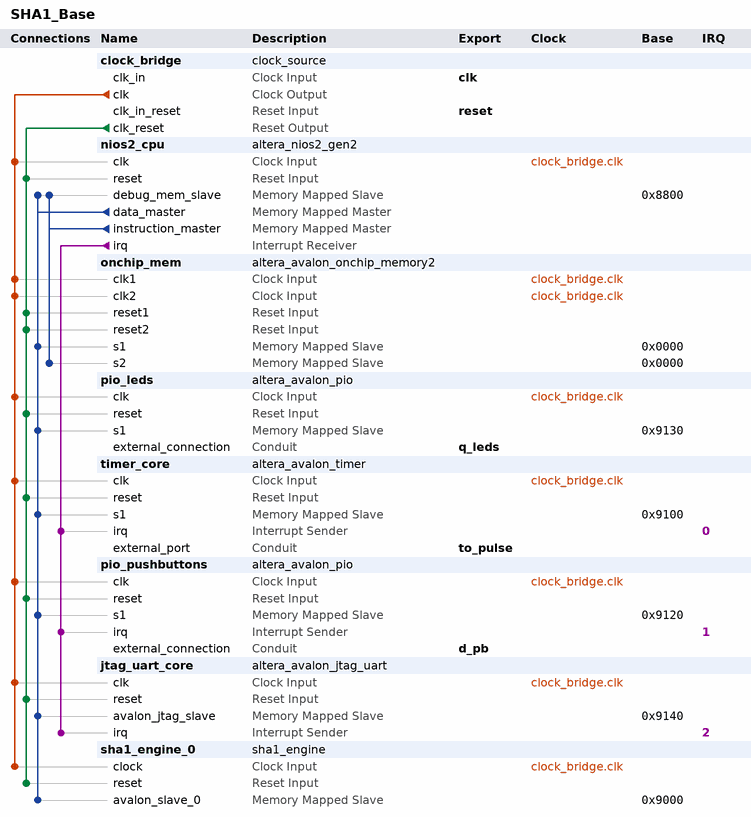
[diagram p0: system contents]
# Platform Designer (Qsys) system SHA1_Base, MAX 10 10M50DAF484C6GES
# Parameters at their usual value, and those the tool derives, are not listed.
package require -exact qsys 18.1
create_system SHA1_Base
set_project_property DEVICE_FAMILY {MAX 10}
set_project_property DEVICE 10M50DAF484C6GES

add_instance clock_bridge clock_source 18.1
set_instance_parameter_value clock_bridge clockFrequency 50000000

add_instance nios2_cpu altera_nios2_gen2 18.1
set_instance_parameter_value nios2_cpu dcache_size 2048
set_instance_parameter_value nios2_cpu exceptionSlave onchip_mem.s2
set_instance_parameter_value nios2_cpu icache_size 4096
set_instance_parameter_value nios2_cpu impl Fast
set_instance_parameter_value nios2_cpu resetSlave onchip_mem.s2

add_instance onchip_mem altera_avalon_onchip_memory2 18.1
set_instance_parameter_value onchip_mem dataWidth 32
set_instance_parameter_value onchip_mem dualPort true
set_instance_parameter_value onchip_mem initMemContent false
set_instance_parameter_value onchip_mem initializationFileName onchip_mem.hex
set_instance_parameter_value onchip_mem memorySize 30000

add_instance pio_leds altera_avalon_pio 18.1
set_instance_parameter_value pio_leds direction Output
set_instance_parameter_value pio_leds width 8

add_instance timer_core altera_avalon_timer 18.1
set_instance_parameter_value timer_core period 1
set_instance_parameter_value timer_core periodUnits MSEC
set_instance_parameter_value timer_core timeoutPulseOutput true

add_instance pio_pushbuttons altera_avalon_pio 18.1
set_instance_parameter_value pio_pushbuttons bitClearingEdgeCapReg true
set_instance_parameter_value pio_pushbuttons captureEdge true
set_instance_parameter_value pio_pushbuttons direction Input
set_instance_parameter_value pio_pushbuttons edgeType FALLING
set_instance_parameter_value pio_pushbuttons generateIRQ true
set_instance_parameter_value pio_pushbuttons irqType EDGE
set_instance_parameter_value pio_pushbuttons width 2

add_instance jtag_uart_core altera_avalon_jtag_uart 18.1
set_instance_parameter_value jtag_uart_core simInteractiveOptions NO_INTERACTIVE_WINDOWS

add_instance sha1_engine_0 sha1_engine 1.0

# connections
add_connection clock_bridge.clk jtag_uart_core.clk clock
add_connection clock_bridge.clk nios2_cpu.clk clock
add_connection clock_bridge.clk onchip_mem.clk1 clock
add_connection clock_bridge.clk onchip_mem.clk2 clock
add_connection clock_bridge.clk pio_leds.clk clock
add_connection clock_bridge.clk pio_pushbuttons.clk clock
add_connection clock_bridge.clk sha1_engine_0.clock clock
add_connection clock_bridge.clk timer_core.clk clock
add_connection clock_bridge.clk_reset jtag_uart_core.reset reset
add_connection clock_bridge.clk_reset nios2_cpu.reset reset
add_connection clock_bridge.clk_reset onchip_mem.reset1 reset
add_connection clock_bridge.clk_reset onchip_mem.reset2 reset
add_connection clock_bridge.clk_reset pio_leds.reset reset
add_connection clock_bridge.clk_reset pio_pushbuttons.reset reset
add_connection clock_bridge.clk_reset sha1_engine_0.reset reset
add_connection clock_bridge.clk_reset timer_core.reset reset
add_connection nios2_cpu.data_master jtag_uart_core.avalon_jtag_slave avalon
set_connection_parameter_value nios2_cpu.data_master/jtag_uart_core.avalon_jtag_slave baseAddress 0x9140
add_connection nios2_cpu.data_master nios2_cpu.debug_mem_slave avalon
set_connection_parameter_value nios2_cpu.data_master/nios2_cpu.debug_mem_slave baseAddress 0x8800
add_connection nios2_cpu.data_master onchip_mem.s1 avalon
set_connection_parameter_value nios2_cpu.data_master/onchip_mem.s1 baseAddress 0x0000
add_connection nios2_cpu.data_master pio_leds.s1 avalon
set_connection_parameter_value nios2_cpu.data_master/pio_leds.s1 baseAddress 0x9130
add_connection nios2_cpu.data_master pio_pushbuttons.s1 avalon
set_connection_parameter_value nios2_cpu.data_master/pio_pushbuttons.s1 baseAddress 0x9120
add_connection nios2_cpu.data_master sha1_engine_0.avalon_slave_0 avalon
set_connection_parameter_value nios2_cpu.data_master/sha1_engine_0.avalon_slave_0 baseAddress 0x9000
add_connection nios2_cpu.data_master timer_core.s1 avalon
set_connection_parameter_value nios2_cpu.data_master/timer_core.s1 baseAddress 0x9100
add_connection nios2_cpu.instruction_master nios2_cpu.debug_mem_slave avalon
set_connection_parameter_value nios2_cpu.instruction_master/nios2_cpu.debug_mem_slave baseAddress 0x8800
add_connection nios2_cpu.instruction_master onchip_mem.s2 avalon
set_connection_parameter_value nios2_cpu.instruction_master/onchip_mem.s2 baseAddress 0x0000
add_connection nios2_cpu.irq jtag_uart_core.irq interrupt
set_connection_parameter_value nios2_cpu.irq/jtag_uart_core.irq irqNumber 2
add_connection nios2_cpu.irq pio_pushbuttons.irq interrupt
set_connection_parameter_value nios2_cpu.irq/pio_pushbuttons.irq irqNumber 1
add_connection nios2_cpu.irq timer_core.irq interrupt
set_connection_parameter_value nios2_cpu.irq/timer_core.irq irqNumber 0

# exported interfaces
add_interface clk clock sink
set_interface_property clk EXPORT_OF clock_bridge.clk_in
add_interface d_pb conduit end
set_interface_property d_pb EXPORT_OF pio_pushbuttons.external_connection
add_interface q_leds conduit end
set_interface_property q_leds EXPORT_OF pio_leds.external_connection
add_interface reset reset sink
set_interface_property reset EXPORT_OF clock_bridge.clk_in_reset
add_interface to_pulse conduit end
set_interface_property to_pulse EXPORT_OF timer_core.external_port

set_interconnect_requirement {$system} qsys_mm.clockCrossingAdapter HANDSHAKE
set_interconnect_requirement {$system} qsys_mm.enableEccProtection FALSE
set_interconnect_requirement {$system} qsys_mm.insertDefaultSlave FALSE
set_interconnect_requirement {$system} qsys_mm.maxAdditionalLatency 1

save_system SHA1_Base.qsys
